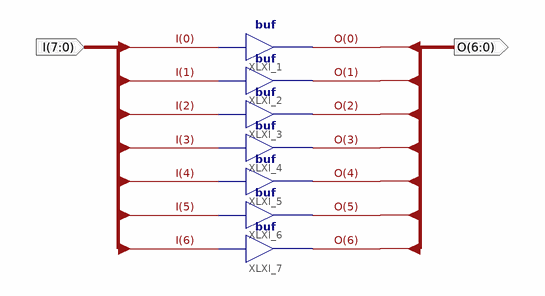
[diagram p0: schematic sheet 1]
// Xilinx ISE schematic resize8x7l.sch (spartan6) as structural Verilog: 7 symbols, 2 ports
module resize8x7l (
  input  [7:0] I,
  output [6:0] O
);

  buf XLXI_1 (O[0], I[0]);
  buf XLXI_2 (O[1], I[1]);
  buf XLXI_3 (O[2], I[2]);
  buf XLXI_4 (O[3], I[3]);
  buf XLXI_5 (O[4], I[4]);
  buf XLXI_6 (O[5], I[5]);
  buf XLXI_7 (O[6], I[6]);
endmodule
